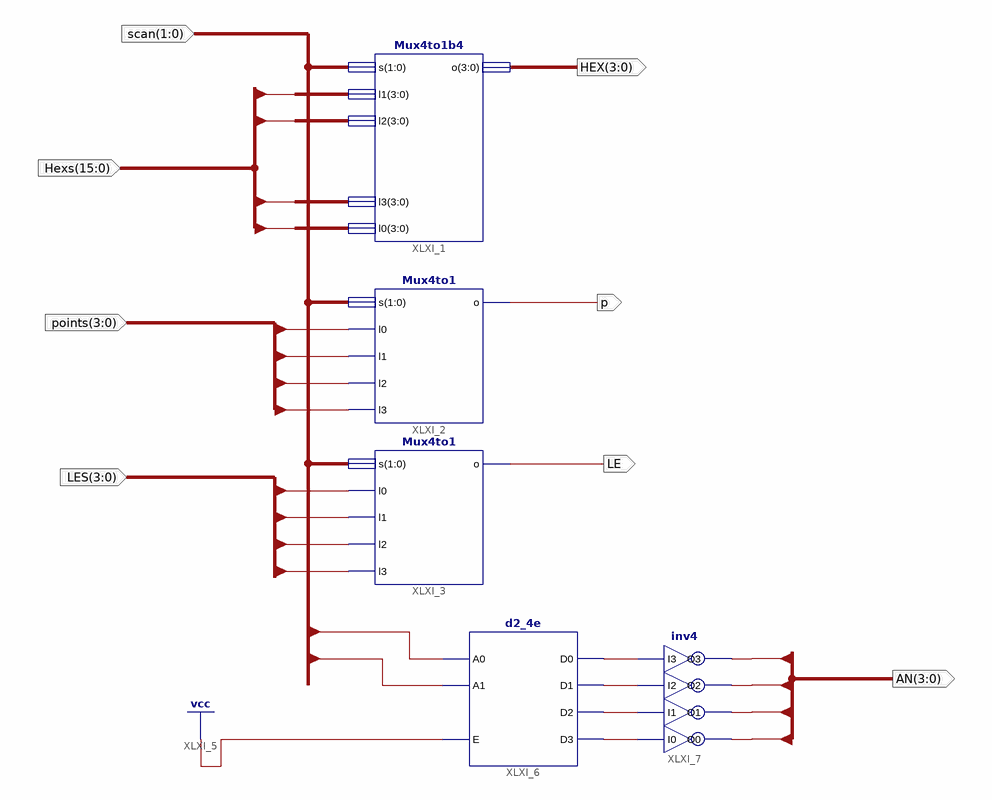
[diagram p0: schematic sheet 1]
// Xilinx ISE schematic DisplaySync_sch.sch (artix7) as structural Verilog: 5 symbols, 8 ports
module DisplaySync_sch (
  input  [1:0] scan,
  input  [15:0] Hexs,
  input  [3:0] points,
  input  [3:0] LES,
  output [3:0] HEX,
  output p,
  output LE,
  output [3:0] AN
);

  wire XLXN_14, XLXN_15, XLXN_16, XLXN_17;

  Mux4to1b4 XLXI_1 (.s(scan), .l1(Hexs[7:4]), .l2(Hexs[11:8]), .l3(Hexs[15:12]), .l0(Hexs[3:0]), .o(HEX));
  Mux4to1 XLXI_2 (.s(scan), .l0(points[0]), .l1(points[1]), .l2(points[2]), .l3(points[3]), .o(p));
  Mux4to1 XLXI_3 (.s(scan), .l0(LES[0]), .l1(LES[1]), .l2(LES[2]), .l3(LES[3]), .o(LE));
  d2_4e XLXI_6 (.A0(scan[0]), .A1(scan[1]), .E(1'b1), .D0(XLXN_14), .D1(XLXN_15), .D2(XLXN_16), .D3(XLXN_17));
  inv4 XLXI_7 (.I0(XLXN_17), .I1(XLXN_16), .I2(XLXN_15), .I3(XLXN_14), .O0(AN[3]), .O1(AN[2]), .O2(AN[1]), .O3(AN[0]));
endmodule
